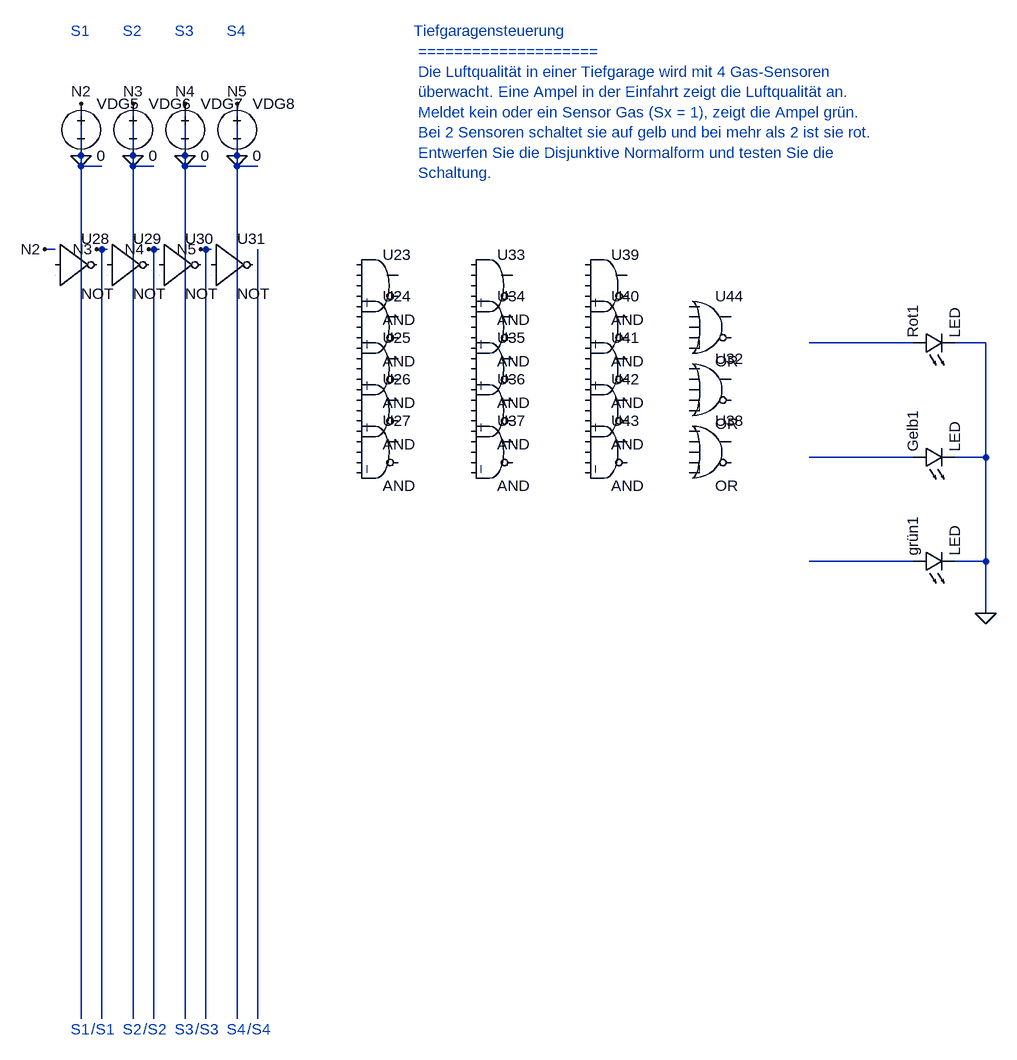
[diagram p0: schematic 2_1_Tiefgaragensteuerung.asc]
2_1_Tiefgaragensteuerung.asc, the LTspice schematic file:
Version 4
SHEET 1 880 680
WIRE 1504 496 1536 496
WIRE 1504 672 1536 672
WIRE 1504 832 1536 832
WIRE 192 224 160 224
WIRE 272 224 240 224
WIRE 320 1536 320 224
WIRE 400 1536 400 224
WIRE 192 1536 192 352
WIRE 272 1536 272 352
WIRE 160 1536 160 224
WIRE 240 1536 240 224
WIRE 352 1536 352 352
WIRE 432 1536 432 352
WIRE 1536 496 1552 496
WIRE 1552 496 1552 672
WIRE 1552 672 1552 832
WIRE 1536 672 1552 672
WIRE 1552 832 1552 912
WIRE 1536 832 1552 832
WIRE 160 128 160 224
WIRE 240 128 240 224
WIRE 320 224 352 224
WIRE 320 128 320 224
WIRE 400 224 432 224
WIRE 400 128 400 224
WIRE 1280 496 1440 496
WIRE 1280 672 1440 672
WIRE 1280 832 1440 832
WIRE 120 352 104 352
WIRE 200 352 184 352
WIRE 280 352 264 352
WIRE 360 352 344 352
FLAG 160 208 0
FLAG 240 208 0
FLAG 320 208 0
FLAG 400 208 0
FLAG 1552 912 0
FLAG 104 352 N2
FLAG 160 128 N2
FLAG 184 352 N3
FLAG 240 128 N3
FLAG 264 352 N4
FLAG 320 128 N4
FLAG 344 352 N5
FLAG 400 128 N5
SYMBOL Digital\and 616 344 R0
SYMATTR InstName U23
SYMATTR Value AND
SYMATTR LibreSpice gate=and;inputs=4;vth=2.5;vhigh=5;pins=In1,In2,In3,In4,Out
SYMBOL Digital\and 616 408 R0
SYMATTR InstName U24
SYMATTR Value AND
SYMATTR LibreSpice gate=and;inputs=4;vth=2.5;vhigh=5;pins=In1,In2,In3,In4,Out
SYMBOL Digital\and 616 472 R0
SYMATTR InstName U25
SYMATTR Value AND
SYMATTR LibreSpice gate=and;inputs=4;vth=2.5;vhigh=5;pins=In1,In2,In3,In4,Out
SYMBOL Digital\and 616 536 R0
SYMATTR InstName U26
SYMATTR Value AND
SYMATTR LibreSpice gate=and;inputs=4;vth=2.5;vhigh=5;pins=In1,In2,In3,In4,Out
SYMBOL Digital\and 616 600 R0
SYMATTR InstName U27
SYMATTR Value AND
SYMATTR LibreSpice gate=and;inputs=4;vth=2.5;vhigh=5;pins=In1,In2,In3,In4,Out
SYMBOL Digital\inv 120 312 R0
SYMATTR InstName U28
SYMATTR Value NOT
SYMATTR LibreSpice gate=not;inputs=1;vth=2.5;vhigh=5;pins=In1,Out
SYMBOL Digital\inv 200 312 R0
SYMATTR InstName U29
SYMATTR Value NOT
SYMATTR LibreSpice gate=not;inputs=1;vth=2.5;vhigh=5;pins=In1,Out
SYMBOL Digital\inv 280 312 R0
SYMATTR InstName U30
SYMATTR Value NOT
SYMATTR LibreSpice gate=not;inputs=1;vth=2.5;vhigh=5;pins=In1,Out
SYMBOL Digital\inv 360 312 R0
SYMATTR InstName U31
SYMATTR Value NOT
SYMATTR LibreSpice gate=not;inputs=1;vth=2.5;vhigh=5;pins=In1,Out
SYMBOL Digital\or 1128 504 R0
SYMATTR InstName U32
SYMATTR Value OR
SYMATTR LibreSpice gate=or;inputs=5;vth=2.5;vhigh=5;pins=In1,In2,In3,In4,In5,Out
SYMBOL Digital\and 792 344 R0
SYMATTR InstName U33
SYMATTR Value AND
SYMATTR LibreSpice gate=and;inputs=4;vth=2.5;vhigh=5;pins=In1,In2,In3,In4,Out
SYMBOL Digital\and 792 408 R0
SYMATTR InstName U34
SYMATTR Value AND
SYMATTR LibreSpice gate=and;inputs=4;vth=2.5;vhigh=5;pins=In1,In2,In3,In4,Out
SYMBOL Digital\and 792 472 R0
SYMATTR InstName U35
SYMATTR Value AND
SYMATTR LibreSpice gate=and;inputs=4;vth=2.5;vhigh=5;pins=In1,In2,In3,In4,Out
SYMBOL Digital\and 792 536 R0
SYMATTR InstName U36
SYMATTR Value AND
SYMATTR LibreSpice gate=and;inputs=4;vth=2.5;vhigh=5;pins=In1,In2,In3,In4,Out
SYMBOL Digital\and 792 600 R0
SYMATTR InstName U37
SYMATTR Value AND
SYMATTR LibreSpice gate=and;inputs=4;vth=2.5;vhigh=5;pins=In1,In2,In3,In4,Out
SYMBOL Digital\or 1128 600 R0
SYMATTR InstName U38
SYMATTR Value OR
SYMATTR LibreSpice gate=or;inputs=5;vth=2.5;vhigh=5;pins=In1,In2,In3,In4,In5,Out
SYMBOL LED 1440 512 R270
SYMATTR InstName Rot1
SYMATTR Value LED
SYMBOL LED 1440 688 R270
SYMATTR InstName Gelb1
SYMATTR Value LED
SYMBOL LED 1440 848 R270
SYMATTR InstName grün1
SYMATTR Value LED
SYMBOL voltage 160 112 R0
SYMATTR InstName VDG5
SYMATTR Value 0
SYMBOL voltage 240 112 R0
SYMATTR InstName VDG6
SYMATTR Value 0
SYMBOL voltage 320 112 R0
SYMATTR InstName VDG7
SYMATTR Value 0
SYMBOL voltage 400 112 R0
SYMATTR InstName VDG8
SYMATTR Value 0
SYMBOL Digital\and 968 344 R0
SYMATTR InstName U39
SYMATTR Value AND
SYMATTR LibreSpice gate=and;inputs=4;vth=2.5;vhigh=5;pins=In1,In2,In3,In4,Out
SYMBOL Digital\and 968 408 R0
SYMATTR InstName U40
SYMATTR Value AND
SYMATTR LibreSpice gate=and;inputs=4;vth=2.5;vhigh=5;pins=In1,In2,In3,In4,Out
SYMBOL Digital\and 968 472 R0
SYMATTR InstName U41
SYMATTR Value AND
SYMATTR LibreSpice gate=and;inputs=4;vth=2.5;vhigh=5;pins=In1,In2,In3,In4,Out
SYMBOL Digital\and 968 536 R0
SYMATTR InstName U42
SYMATTR Value AND
SYMATTR LibreSpice gate=and;inputs=4;vth=2.5;vhigh=5;pins=In1,In2,In3,In4,Out
SYMBOL Digital\and 968 600 R0
SYMATTR InstName U43
SYMATTR Value AND
SYMATTR LibreSpice gate=and;inputs=4;vth=2.5;vhigh=5;pins=In1,In2,In3,In4,Out
SYMBOL Digital\or 1128 408 R0
SYMATTR InstName U44
SYMATTR Value OR
SYMATTR LibreSpice gate=or;inputs=5;vth=2.5;vhigh=5;pins=In1,In2,In3,In4,In5,Out
TEXT 672 16 Left 2 ;Tiefgaragensteuerung \n ==================== \n Die Luftqualität in einer Tiefgarage wird mit 4 Gas-Sensoren \n überwacht. Eine Ampel in der Einfahrt zeigt die Luftqualität an. \n Meldet kein oder ein Sensor Gas (Sx = 1), zeigt die Ampel grün. \n Bei 2 Sensoren schaltet sie auf gelb und bei mehr als 2 ist sie rot. \n Entwerfen Sie die Disjunktive Normalform und testen Sie die \n Schaltung.
TEXT 144 16 Left 2 ;S1
TEXT 224 16 Left 2 ;S2
TEXT 304 16 Left 2 ;S3
TEXT 384 16 Left 2 ;S4
TEXT 144 1552 Left 2 ;S1
TEXT 224 1552 Left 2 ;S2
TEXT 304 1552 Left 2 ;S3
TEXT 384 1552 Left 2 ;S4
TEXT 176 1552 Left 2 ;/S1
TEXT 256 1552 Left 2 ;/S2
TEXT 336 1552 Left 2 ;/S3
TEXT 416 1552 Left 2 ;/S4

The netlist it stands for:
* 2_1_Tiefgaragensteuerung.asc
A§U23 0 0 0 0 P001 0 0 0 AND AND
A§U24 P001 0 0 0 P002 0 0 0 AND AND
A§U25 P002 0 0 0 P003 0 0 0 AND AND
A§U26 P003 0 0 0 P004 0 0 0 AND AND
A§U27 P004 0 0 0 0 0 0 0 AND AND
A§U28 0 0 0 0 0 0 0 0 BUF NOT
A§U29 0 0 0 0 0 0 0 0 BUF NOT
A§U30 0 0 0 0 0 0 0 0 BUF NOT
A§U31 0 0 0 0 0 0 0 0 BUF NOT
A§U32 0 0 0 0 0 0 0 0 OR OR
A§U33 0 0 0 0 P005 0 0 0 AND AND
A§U34 P005 0 0 0 P006 0 0 0 AND AND
A§U35 P006 0 0 0 P007 0 0 0 AND AND
A§U36 P007 0 0 0 P008 0 0 0 AND AND
A§U37 P008 0 0 0 0 0 0 0 AND AND
A§U38 0 0 0 0 0 0 0 0 OR OR
D§Rot1 N002 0 LED
D§Gelb1 N003 0 LED
D§grün1 N004 0 LED
VDG5 0 0 0
VDG6 0 0 0
VDG7 0 0 0
VDG8 0 0 0
A§U39 0 0 0 0 P009 0 0 0 AND AND
A§U40 P009 0 0 0 P010 0 0 0 AND AND
A§U41 P010 0 0 0 P011 0 0 0 AND AND
A§U42 P011 0 0 0 P012 0 0 0 AND AND
A§U43 P012 0 0 0 0 0 0 0 AND AND
A§U44 0 0 0 0 0 0 0 0 OR OR
.model D D
.lib standard.dio
* Tiefgaragensteuerung
*  ====================
*  Die Luftqualität in einer Tiefgarage wird mit 4 Gas-Sensoren
*  überwacht. Eine Ampel in der Einfahrt zeigt die Luftqualität an.
*  Meldet kein oder ein Sensor Gas (Sx = 1), zeigt die Ampel grün.
*  Bei 2 Sensoren schaltet sie auf gelb und bei mehr als 2 ist sie rot.
*  Entwerfen Sie die Disjunktive Normalform und testen Sie die
*  Schaltung.
* S1
* S2
* S3
* S4
* S1
* S2
* S3
* S4
* /S1
* /S2
* /S3
* /S4
.backanno
.end